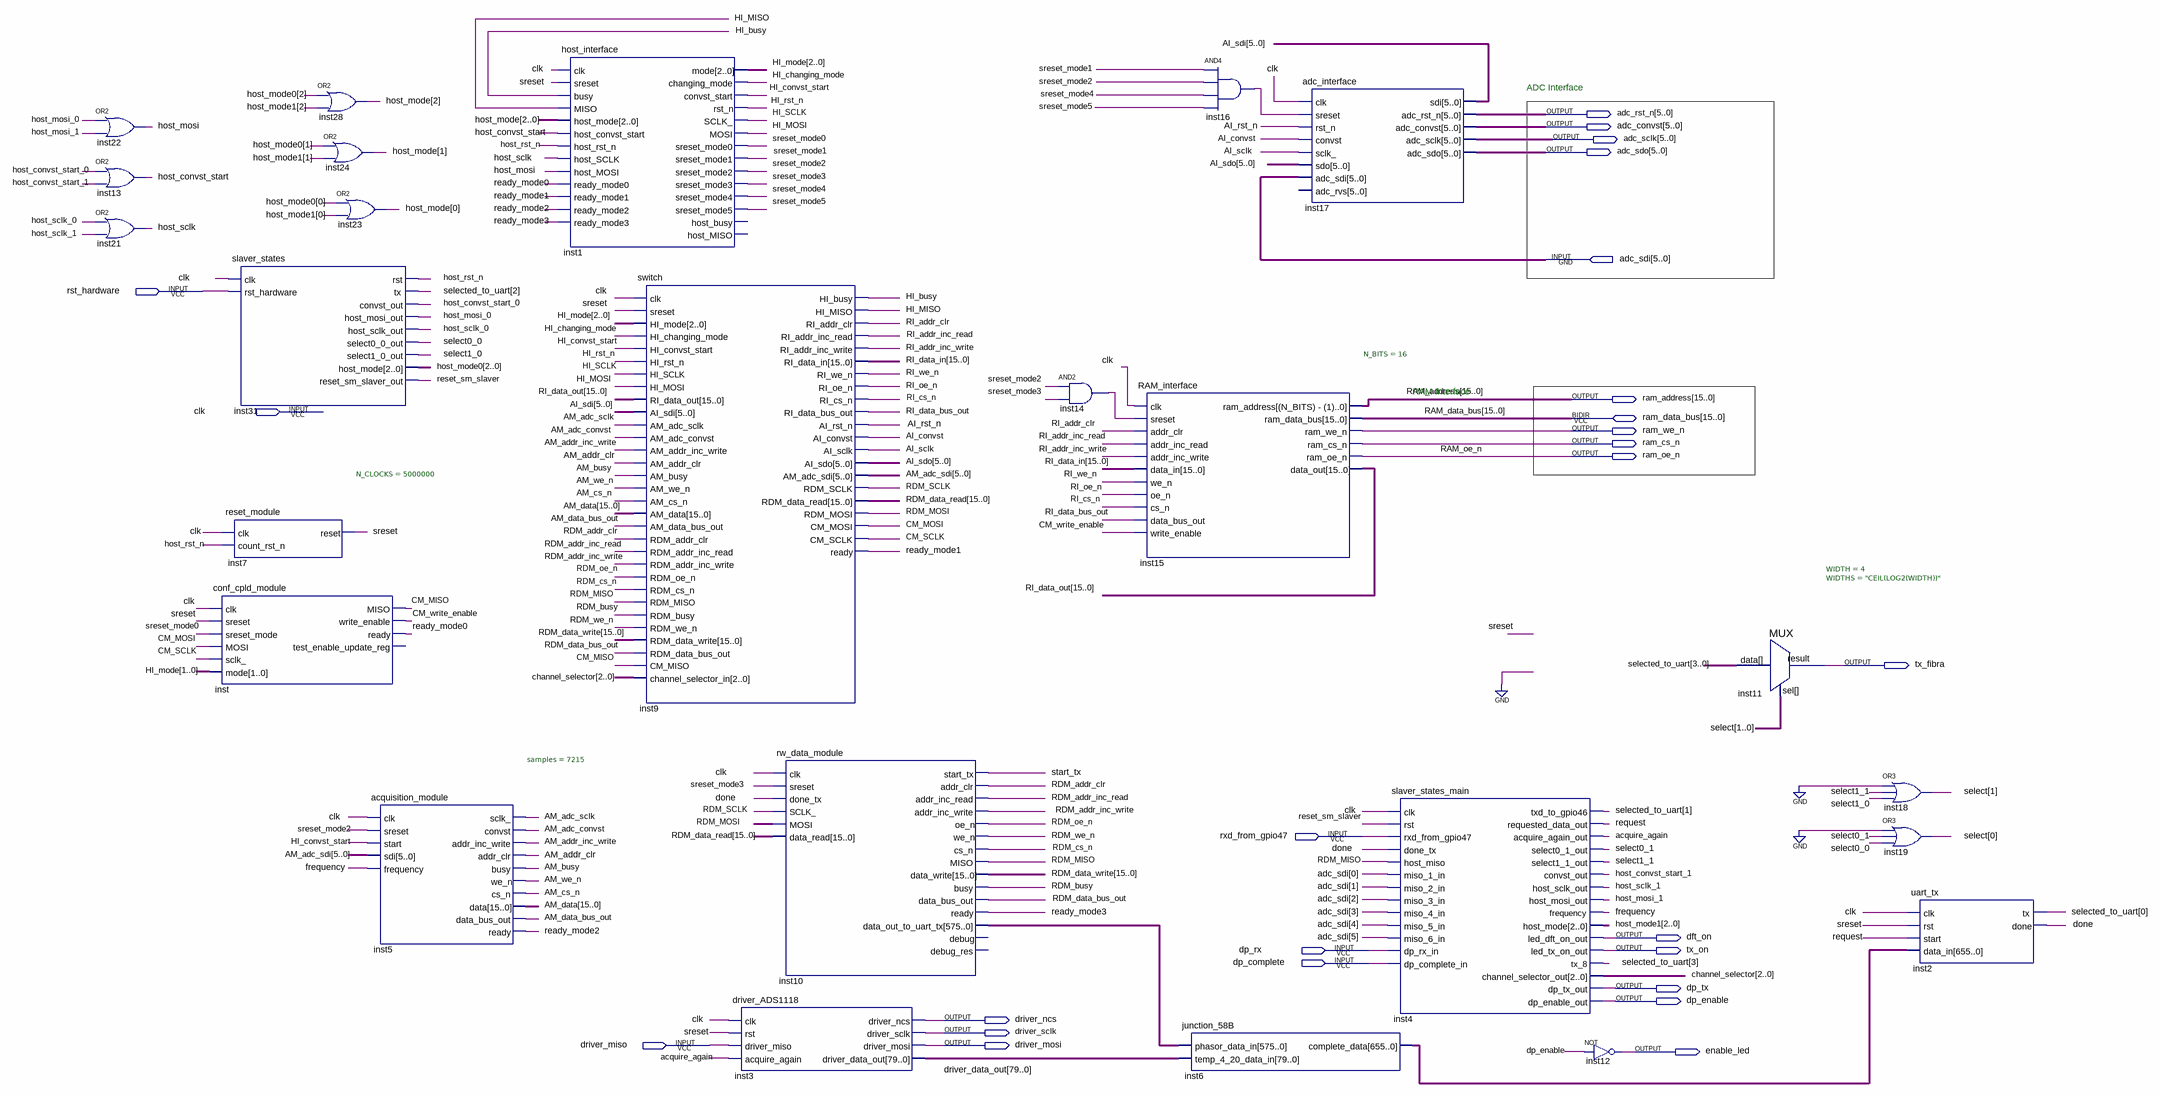
[diagram p0: schematic sheet]
// Quartus schematic sensor_buchas.bdf as structural Verilog: 25 symbols, 25 pins
module sensor_buchas (
  input  [5:0] adc_sdi,
  input  rst_hardware,
  input  clk,
  input  rxd_from_gpio47,
  input  dp_rx,
  input  dp_complete,
  input  driver_miso,
  inout  [15:0] ram_data_bus,
  output [5:0] adc_rst_n,
  output [5:0] adc_convst,
  output [5:0] adc_sclk,
  output [5:0] adc_sdo,
  output [15:0] ram_address,
  output ram_we_n,
  output ram_cs_n,
  output ram_oe_n,
  output tx_fibra,
  output dft_on,
  output tx_on,
  output dp_tx,
  output dp_enable,
  output driver_ncs,
  output driver_sclk,
  output driver_mosi,
  output enable_led
);

  wire acquire_again, AI_convst, AI_rst_n, AI_sclk, AM_adc_convst, AM_adc_sclk, AM_addr_clr,
       AM_addr_inc_write, AM_busy, AM_cs_n, AM_data_bus_out, AM_we_n, CM_MISO, CM_MOSI, CM_SCLK,
       CM_write_enable, done, frequency, HI_busy, HI_changing_mode, HI_convst_start, HI_MISO, HI_MOSI,
       HI_rst_n, HI_SCLK, host_convst_start, host_convst_start_0, host_convst_start_1, host_mosi,
       host_mosi_0, host_mosi_1, host_rst_n, host_sclk, host_sclk_0, host_sclk_1, inst14_out, inst16_out,
       RDM_addr_clr, RDM_addr_inc_read, RDM_addr_inc_write, RDM_busy, RDM_cs_n, RDM_data_bus_out, RDM_MISO,
       RDM_MOSI, RDM_oe_n, RDM_SCLK, RDM_we_n, ready_mode0, ready_mode1, ready_mode2, ready_mode3, request,
       reset_sm_slaver, RI_addr_clr, RI_addr_inc_read, RI_addr_inc_write, RI_cs_n, RI_data_bus_out, RI_oe_n,
       RI_we_n, select0_0, select0_1, select1_0, select1_1, sreset, sreset_mode0, sreset_mode1, sreset_mode2,
       sreset_mode3, sreset_mode4, sreset_mode5, start_tx;
  wire [1:0] select;
  wire [2:0] channel_selector, HI_mode, host_mode, host_mode0, host_mode1;
  wire [3:0] selected_to_uart;
  wire [5:0] AI_sdi, AI_sdo, AM_adc_sdi;
  wire [15:0] AM_data, RDM_data_read, RDM_data_write, RI_data_in, RI_data_out;
  wire [79:0] driver_data_out;
  wire [575:0] inst10_data_out_to_uart_tx;
  wire [655:0] inst6_complete_data;

  or inst22 (host_mosi, host_mosi_0, host_mosi_1);
  or inst13 (host_convst_start, host_convst_start_0, host_convst_start_1);
  or inst21 (host_sclk, host_sclk_0, host_sclk_1);
  slaver_states inst31 (
    .clk(clk), .rst_hardware(rst_hardware), .rst(host_rst_n), .tx(selected_to_uart[2]),
    .convst_out(host_convst_start_0), .host_mosi_out(host_mosi_0), .host_sclk_out(host_sclk_0),
    .select0_0_out(select0_0), .select1_0_out(select1_0), .host_mode(host_mode0),
    .reset_sm_slaver_out(reset_sm_slaver));
  reset_module #(.N_CLOCKS(5000000)) inst7 (.clk(clk), .count_rst_n(host_rst_n), .reset(sreset));
  conf_cpld_module inst (
    .clk(clk), .sreset(sreset), .sreset_mode(sreset_mode0), .MOSI(CM_MOSI), .sclk_(CM_SCLK),
    .mode(HI_mode[1:0]), .MISO(CM_MISO), .write_enable(CM_write_enable), .ready(ready_mode0));  // open: test_enable_update_reg
  or inst28 (host_mode[2], host_mode0[2], host_mode1[2]);
  or inst24 (host_mode[1], host_mode0[1], host_mode1[1]);
  or inst23 (host_mode[0], host_mode0[0], host_mode1[0]);
  acquisition_module #(.samples(7215)) inst5 (
    .clk(clk), .sreset(sreset_mode2), .start(HI_convst_start), .sdi(AM_adc_sdi), .frequency(frequency),
    .sclk_(AM_adc_sclk), .convst(AM_adc_convst), .addr_inc_write(AM_addr_inc_write), .addr_clr(AM_addr_clr),
    .busy(AM_busy), .we_n(AM_we_n), .cs_n(AM_cs_n), .data(AM_data), .data_bus_out(AM_data_bus_out),
    .ready(ready_mode2));
  host_interface inst1 (
    .clk(clk), .sreset(sreset), .busy(HI_busy), .MISO(HI_MISO), .host_mode(host_mode),
    .host_convst_start(host_convst_start), .host_rst_n(host_rst_n), .host_SCLK(host_sclk),
    .host_MOSI(host_mosi), .ready_mode0(ready_mode0), .ready_mode1(ready_mode1), .ready_mode2(ready_mode2),
    .ready_mode3(ready_mode3), .mode(HI_mode), .changing_mode(HI_changing_mode),
    .convst_start(HI_convst_start), .rst_n(HI_rst_n), .SCLK_(HI_SCLK), .MOSI(HI_MOSI),
    .sreset_mode0(sreset_mode0), .sreset_mode1(sreset_mode1), .sreset_mode2(sreset_mode2),
    .sreset_mode3(sreset_mode3), .sreset_mode4(sreset_mode4), .sreset_mode5(sreset_mode5));  // open: host_busy, host_MISO
  switch inst9 (
    .clk(clk), .sreset(sreset), .HI_mode(HI_mode), .HI_changing_mode(HI_changing_mode),
    .HI_convst_start(HI_convst_start), .HI_rst_n(HI_rst_n), .HI_SCLK(HI_SCLK), .HI_MOSI(HI_MOSI),
    .RI_data_out(RI_data_out), .AI_sdi(AI_sdi), .AM_adc_sclk(AM_adc_sclk), .AM_adc_convst(AM_adc_convst),
    .AM_addr_inc_write(AM_addr_inc_write), .AM_addr_clr(AM_addr_clr), .AM_busy(AM_busy), .AM_we_n(AM_we_n),
    .AM_cs_n(AM_cs_n), .AM_data(AM_data), .AM_data_bus_out(AM_data_bus_out), .RDM_addr_clr(RDM_addr_clr),
    .RDM_addr_inc_read(RDM_addr_inc_read), .RDM_addr_inc_write(RDM_addr_inc_write), .RDM_oe_n(RDM_oe_n),
    .RDM_cs_n(RDM_cs_n), .RDM_MISO(RDM_MISO), .RDM_busy(RDM_busy), .RDM_we_n(RDM_we_n),
    .RDM_data_write(RDM_data_write), .RDM_data_bus_out(RDM_data_bus_out), .CM_MISO(CM_MISO),
    .channel_selector_in(channel_selector), .HI_busy(HI_busy), .HI_MISO(HI_MISO), .RI_addr_clr(RI_addr_clr),
    .RI_addr_inc_read(RI_addr_inc_read), .RI_addr_inc_write(RI_addr_inc_write), .RI_data_in(RI_data_in),
    .RI_we_n(RI_we_n), .RI_oe_n(RI_oe_n), .RI_cs_n(RI_cs_n), .RI_data_bus_out(RI_data_bus_out),
    .AI_rst_n(AI_rst_n), .AI_convst(AI_convst), .AI_sclk(AI_sclk), .AI_sdo(AI_sdo), .AM_adc_sdi(AM_adc_sdi),
    .RDM_SCLK(RDM_SCLK), .RDM_data_read(RDM_data_read), .RDM_MOSI(RDM_MOSI), .CM_MOSI(CM_MOSI),
    .CM_SCLK(CM_SCLK), .ready(ready_mode1));
  driver_ADS1118 inst3 (
    .clk(clk), .rst(sreset), .driver_miso(driver_miso), .acquire_again(acquire_again),
    .driver_ncs(driver_ncs), .driver_sclk(driver_sclk), .driver_mosi(driver_mosi),
    .driver_data_out(driver_data_out));
  rw_data_module inst10 (
    .clk(clk), .sreset(sreset_mode3), .done_tx(done), .SCLK_(RDM_SCLK), .MOSI(RDM_MOSI),
    .data_read(RDM_data_read), .start_tx(start_tx), .addr_clr(RDM_addr_clr),
    .addr_inc_read(RDM_addr_inc_read), .addr_inc_write(RDM_addr_inc_write), .oe_n(RDM_oe_n), .we_n(RDM_we_n),
    .cs_n(RDM_cs_n), .MISO(RDM_MISO), .data_write(RDM_data_write), .busy(RDM_busy),
    .data_bus_out(RDM_data_bus_out), .ready(ready_mode3), .data_out_to_uart_tx(inst10_data_out_to_uart_tx));  // open: debug, debug_res
  and inst14 (inst14_out, sreset_mode2, sreset_mode3);
  RAM_interface #(.N_BITS(16)) inst15 (
    .clk(clk), .sreset(inst14_out), .addr_clr(RI_addr_clr), .addr_inc_read(RI_addr_inc_read),
    .addr_inc_write(RI_addr_inc_write), .data_in(RI_data_in), .we_n(RI_we_n), .oe_n(RI_oe_n), .cs_n(RI_cs_n),
    .data_bus_out(RI_data_bus_out), .write_enable(CM_write_enable), .ram_address(ram_address),
    .ram_we_n(ram_we_n), .ram_cs_n(ram_cs_n), .ram_oe_n(ram_oe_n), .data_out(RI_data_out),
    .ram_data_bus(ram_data_bus));
  junction_58B inst6 (
    .phasor_data_in(inst10_data_out_to_uart_tx), .temp_4_20_data_in(driver_data_out),
    .complete_data(inst6_complete_data));
  and inst16 (inst16_out, sreset_mode1, sreset_mode2, sreset_mode4, sreset_mode5);
  adc_interface inst17 (
    .clk(clk), .sreset(inst16_out), .rst_n(AI_rst_n), .convst(AI_convst), .sclk_(AI_sclk), .sdo(AI_sdo),
    .adc_sdi(adc_sdi), .sdi(AI_sdi), .adc_rst_n(adc_rst_n), .adc_convst(adc_convst), .adc_sclk(adc_sclk),
    .adc_sdo(adc_sdo));  // open: adc_rvs
  slaver_states_main inst4 (
    .clk(clk), .rst(reset_sm_slaver), .rxd_from_gpio47(rxd_from_gpio47), .done_tx(done),
    .host_miso(RDM_MISO), .miso_1_in(adc_sdi[0]), .miso_2_in(adc_sdi[1]), .miso_3_in(adc_sdi[2]),
    .miso_4_in(adc_sdi[3]), .miso_5_in(adc_sdi[4]), .miso_6_in(adc_sdi[5]), .dp_rx_in(dp_rx),
    .dp_complete_in(dp_complete), .txd_to_gpio46(selected_to_uart[1]), .requested_data_out(request),
    .acquire_again_out(acquire_again), .select0_1_out(select0_1), .select1_1_out(select1_1),
    .convst_out(host_convst_start_1), .host_sclk_out(host_sclk_1), .host_mosi_out(host_mosi_1),
    .frequency(frequency), .host_mode(host_mode1), .led_dft_on_out(dft_on), .led_tx_on_out(tx_on),
    .tx_8(selected_to_uart[3]), .channel_selector_out(channel_selector), .dp_tx_out(dp_tx),
    .dp_enable_out(dp_enable));
  not inst12 (enable_led, dp_enable);
  MUX #(.WIDTH(4), .WIDTHS("CEIL(LOG2(WIDTH))")) inst11 (.data(selected_to_uart), .sel(select), .result(tx_fibra));
  or inst18 (select[1], 1'b0, select1_1, select1_0);
  or inst19 (select[0], 1'b0, select0_1, select0_0);
  uart_tx inst2 (
    .clk(clk), .rst(sreset), .start(request), .data_in(inst6_complete_data), .tx(selected_to_uart[0]),
    .done(done));

  // Notes on the sheet:
  //   ADC Interface
  //   RAM Interface
endmodule
